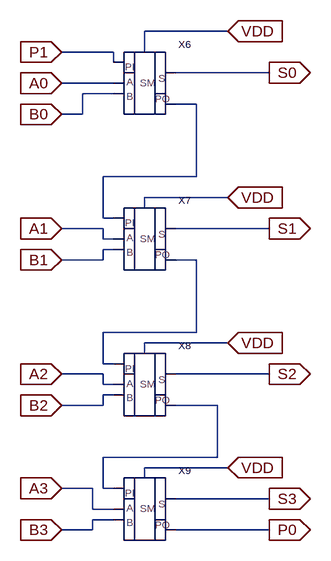
[diagram p0: schematic adder4.asc]
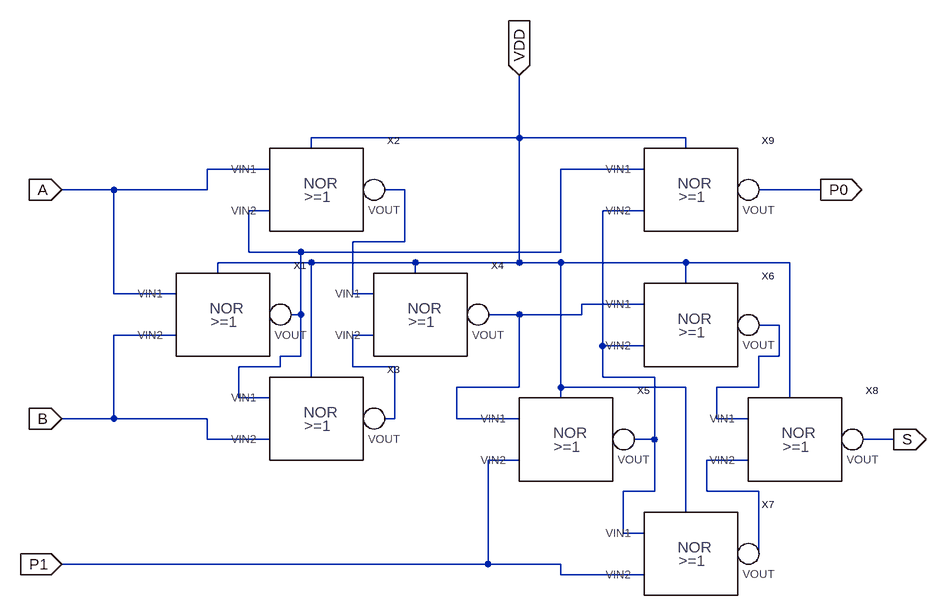
[diagram p1: sub-circuit adder.asc]
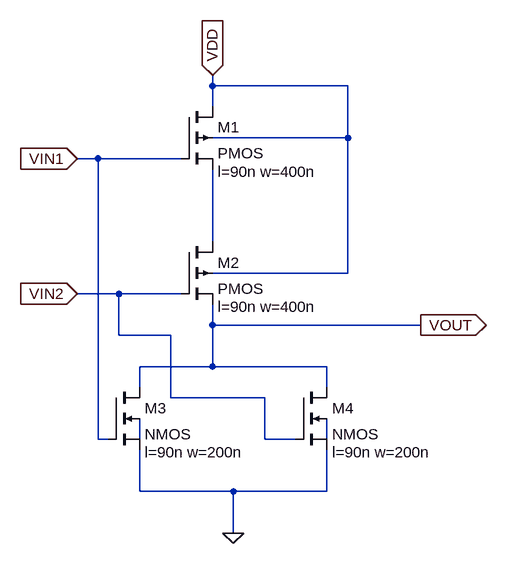
[diagram p2: sub-circuit nor.asc]
adder4.asc, the LTspice schematic file:
Version 4
SHEET 1 880 788
WIRE -224 -160 -352 -160
WIRE -400 -128 -480 -128
WIRE -352 -128 -352 -160
WIRE -400 -112 -400 -128
WIRE -384 -112 -400 -112
WIRE -160 -96 -320 -96
WIRE -384 -80 -480 -80
WIRE -384 -64 -448 -64
WIRE -272 -48 -320 -48
WIRE -448 -32 -448 -64
WIRE -448 -32 -480 -32
WIRE -272 64 -272 -48
WIRE -272 64 -416 64
WIRE -224 96 -352 96
WIRE -352 112 -352 96
WIRE -416 128 -416 64
WIRE -384 128 -416 128
WIRE -416 144 -480 144
WIRE -160 144 -320 144
WIRE -416 160 -416 144
WIRE -384 160 -416 160
WIRE -384 176 -416 176
WIRE -416 192 -416 176
WIRE -416 192 -480 192
WIRE -272 192 -320 192
WIRE -272 304 -272 192
WIRE -272 304 -416 304
WIRE -224 320 -352 320
WIRE -352 336 -352 320
WIRE -416 352 -416 304
WIRE -384 352 -416 352
WIRE -416 368 -480 368
WIRE -160 368 -320 368
WIRE -416 384 -416 368
WIRE -384 384 -416 384
WIRE -384 400 -416 400
WIRE -416 416 -416 400
WIRE -416 416 -480 416
WIRE -240 416 -320 416
WIRE -240 496 -240 416
WIRE -240 496 -416 496
WIRE -224 512 -352 512
WIRE -352 528 -352 512
WIRE -432 544 -480 544
WIRE -416 544 -416 496
WIRE -384 544 -416 544
WIRE -160 560 -320 560
WIRE -432 576 -432 544
WIRE -384 576 -432 576
WIRE -384 592 -432 592
WIRE -432 608 -432 592
WIRE -432 608 -480 608
WIRE -160 608 -320 608
FLAG -480 -128 P1
IOPIN -480 -128 In
FLAG -480 -80 A0
IOPIN -480 -80 In
FLAG -480 -32 B0
IOPIN -480 -32 In
FLAG -480 144 A1
IOPIN -480 144 In
FLAG -480 192 B1
IOPIN -480 192 In
FLAG -480 368 A2
IOPIN -480 368 In
FLAG -480 416 B2
IOPIN -480 416 In
FLAG -480 544 A3
IOPIN -480 544 In
FLAG -480 608 B3
IOPIN -480 608 In
FLAG -224 96 VDD
IOPIN -224 96 In
FLAG -160 -96 S0
IOPIN -160 -96 Out
FLAG -160 144 S1
IOPIN -160 144 Out
FLAG -160 368 S2
IOPIN -160 368 Out
FLAG -160 560 S3
IOPIN -160 560 Out
FLAG -160 608 P0
IOPIN -160 608 Out
FLAG -224 512 VDD
IOPIN -224 512 In
FLAG -224 320 VDD
IOPIN -224 320 In
FLAG -224 -160 VDD
IOPIN -224 -160 In
SYMBOL adder -352 -80 R0
SYMATTR InstName X6
SYMBOL adder -352 160 R0
SYMATTR InstName X7
SYMBOL adder -352 384 R0
SYMATTR InstName X8
SYMBOL adder -352 576 R0
SYMATTR InstName X9

adder.asc, the sub-circuit schematic file:
Version 4
SHEET 1 1680 804
WIRE 640 80 640 -16
WIRE 640 80 320 80
WIRE 896 80 640 80
WIRE 320 96 320 80
WIRE 896 96 896 80
WIRE 256 128 160 128
WIRE 832 128 704 128
WIRE 16 160 -64 160
WIRE 160 160 160 128
WIRE 160 160 16 160
WIRE 464 160 432 160
WIRE 1104 160 1008 160
WIRE 256 192 224 192
WIRE 832 192 768 192
WIRE 464 240 464 160
WIRE 464 240 384 240
WIRE 224 256 224 192
WIRE 304 256 224 256
WIRE 704 256 704 128
WIRE 704 256 304 256
WIRE 320 272 176 272
WIRE 480 272 320 272
WIRE 640 272 640 80
WIRE 640 272 480 272
WIRE 704 272 640 272
WIRE 896 272 704 272
WIRE 1056 272 896 272
WIRE 176 288 176 272
WIRE 480 288 480 272
WIRE 896 304 896 272
WIRE 16 320 16 160
WIRE 112 320 16 320
WIRE 384 320 384 240
WIRE 416 320 384 320
WIRE 832 336 736 336
WIRE 304 352 304 256
WIRE 304 352 288 352
WIRE 640 352 592 352
WIRE 736 352 736 336
WIRE 736 352 640 352
WIRE 1040 368 1008 368
WIRE 112 384 16 384
WIRE 416 384 384 384
WIRE 768 400 768 192
WIRE 832 400 768 400
WIRE 304 416 304 352
WIRE 304 416 272 416
WIRE 1040 416 1040 368
WIRE 1040 416 1008 416
WIRE 272 432 272 416
WIRE 272 432 208 432
WIRE 384 432 384 384
WIRE 448 432 384 432
WIRE 320 448 320 272
WIRE 768 448 768 400
WIRE 848 448 768 448
WIRE 640 464 640 352
WIRE 640 464 544 464
WIRE 704 464 704 272
WIRE 896 464 704 464
WIRE 1008 464 1008 416
WIRE 1008 464 944 464
WIRE 208 480 208 432
WIRE 256 480 208 480
WIRE 704 480 704 464
WIRE 1056 480 1056 272
WIRE 16 512 16 384
WIRE 16 512 -64 512
WIRE 160 512 16 512
WIRE 448 512 448 432
WIRE 448 512 432 512
WIRE 544 512 544 464
WIRE 640 512 544 512
WIRE 944 512 944 464
WIRE 992 512 944 512
WIRE 160 544 160 512
WIRE 256 544 160 544
WIRE 848 544 848 448
WIRE 848 544 816 544
WIRE 1216 544 1168 544
WIRE 640 576 592 576
WIRE 992 576 928 576
WIRE 848 624 848 544
WIRE 848 624 800 624
WIRE 928 624 928 576
WIRE 1008 624 928 624
WIRE 896 656 896 464
WIRE 800 688 800 624
WIRE 832 688 800 688
WIRE 1008 720 1008 624
WIRE 592 736 592 576
WIRE 592 736 -64 736
WIRE 704 736 592 736
WIRE 704 752 704 736
WIRE 832 752 704 752
FLAG -64 736 P1
IOPIN -64 736 In
FLAG -64 160 A
IOPIN -64 160 In
FLAG 640 -16 VDD
IOPIN 640 -16 In
FLAG 1216 544 S
IOPIN 1216 544 Out
FLAG 1104 160 P0
IOPIN 1104 160 Out
FLAG -64 512 B
IOPIN -64 512 In
SYMBOL nor 96 320 R0
SYMATTR InstName X1
SYMBOL nor 240 128 R0
SYMATTR InstName X2
SYMBOL nor 240 480 R0
SYMATTR InstName X3
SYMBOL nor 400 320 R0
SYMATTR InstName X4
SYMBOL nor 624 512 R0
SYMATTR InstName X5
SYMBOL nor 816 336 R0
SYMATTR InstName X6
SYMBOL nor 816 688 R0
SYMATTR InstName X7
SYMBOL nor 976 512 R0
SYMATTR InstName X8
SYMBOL nor 816 128 R0
SYMATTR InstName X9

nor.asc, the sub-circuit schematic file:
Version 4
SHEET 1 880 680
WIRE -32 -64 -32 -80
WIRE 176 -64 -32 -64
WIRE -32 -32 -32 -64
WIRE 176 16 176 -64
WIRE 176 16 -32 16
WIRE -208 48 -240 48
WIRE -80 48 -208 48
WIRE -32 176 -32 64
WIRE 176 224 176 16
WIRE 176 224 -32 224
WIRE -176 256 -240 256
WIRE -80 256 -176 256
WIRE -32 304 -32 272
WIRE 288 304 -32 304
WIRE -176 320 -176 256
WIRE -96 320 -176 320
WIRE -32 368 -32 304
WIRE -32 368 -144 368
WIRE 144 368 -32 368
WIRE -144 400 -144 368
WIRE 144 400 144 368
WIRE -96 416 -96 320
WIRE 48 416 -96 416
WIRE -208 480 -208 48
WIRE -192 480 -208 480
WIRE -144 480 -144 448
WIRE 48 480 48 416
WIRE 96 480 48 480
WIRE 144 480 144 448
WIRE -144 560 -144 496
WIRE 0 560 -144 560
WIRE 144 560 144 496
WIRE 144 560 0 560
WIRE 0 624 0 560
FLAG -32 -80 VDD
IOPIN -32 -80 In
FLAG -240 48 VIN1
IOPIN -240 48 In
FLAG -240 256 VIN2
IOPIN -240 256 In
FLAG 288 304 VOUT
IOPIN 288 304 Out
FLAG 0 624 0
SYMBOL pmos4 -80 -32 R0
WINDOW 123 56 100 Left 2
SYMATTR Value2 l=90n w=400n
SYMATTR InstName M1
SYMBOL pmos4 -80 176 R0
WINDOW 123 56 100 Left 2
SYMATTR Value2 l=90n w=400n
SYMATTR InstName M2
SYMBOL nmos4 -192 400 R0
WINDOW 123 56 100 Left 2
SYMATTR Value2 l=90n w=200n
SYMATTR InstName M3
SYMBOL nmos4 96 400 R0
WINDOW 123 56 100 Left 2
SYMATTR Value2 l=90n w=200n
SYMATTR InstName M4

The netlist it stands for:
* adder4.asc
XX6 P1 A0 B0 S0 N001 VDD adder
XX7 N001 A1 B1 S1 N002 VDD adder
XX8 N002 A2 B2 S2 N003 VDD adder
XX9 N003 A3 B3 S3 P0 VDD adder

* block symbol definitions
.subckt adder P1 A B S P0 VDD
XX1 A B N001 VDD nor
XX2 A N001 N002 VDD nor
XX3 N001 B N006 VDD nor
XX4 N002 N006 N004 VDD nor
XX5 N004 P1 N003 VDD nor
XX6 N004 N003 N005 VDD nor
XX7 N003 P1 N007 VDD nor
XX8 N005 N007 S VDD nor
XX9 N001 N003 P0 VDD nor
.ends adder

.subckt nor VIN1 VIN2 VOUT VDD
M1 VDD VIN1 N001 VDD PMOS l=90n w=400n
M2 N001 VIN2 VOUT VDD PMOS l=90n w=400n
M3 VOUT VIN1 0 N002 NMOS l=90n w=200n
M4 VOUT VIN2 0 N003 NMOS l=90n w=200n
.ends nor

.model NMOS NMOS
.model PMOS PMOS
.lib standard.mos
.backanno
.end